# EAGLE design LED_Project (EAGLE 9.2.2)
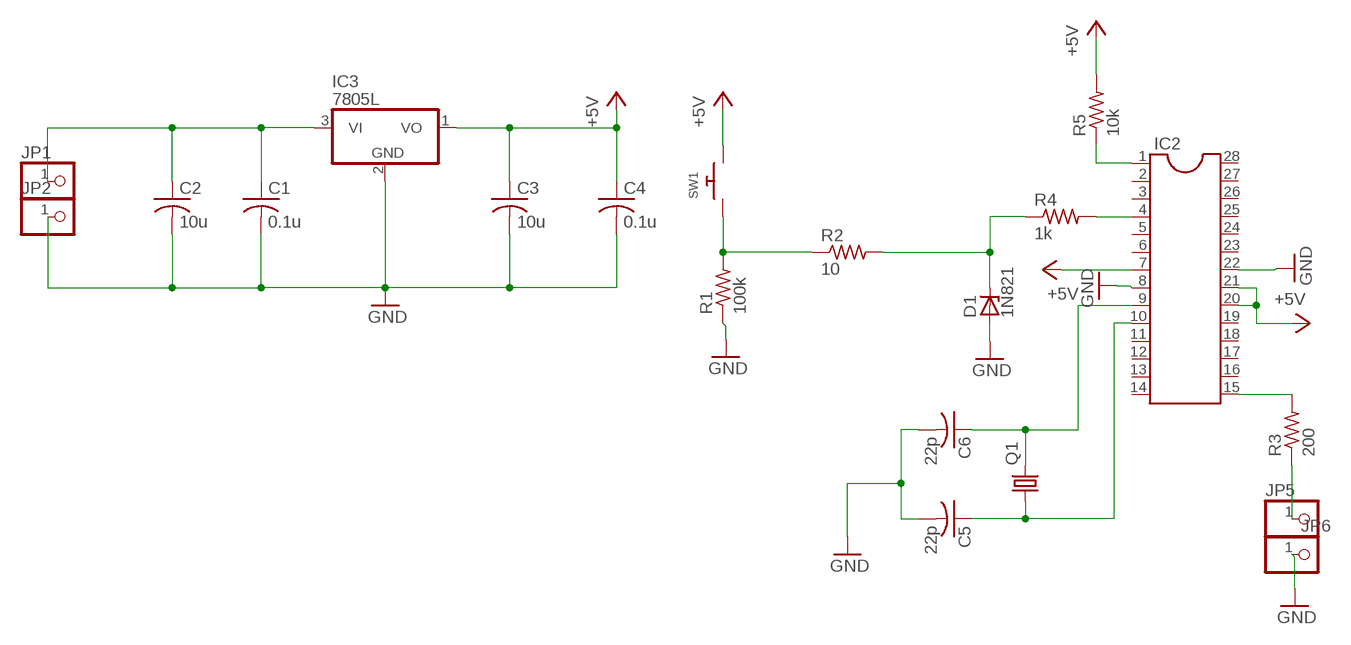
[diagram p0: schematic, sheet 1]

## Parts
C1  0.1u  C-USC0805K  [C0805K]
C2  10u  C-USC0805K  [C0805K]
C3  10u  C-USC0805K  [C0805K]
C4  0.1u  C-USC0805K  [C0805K]
C5  22p  C-USC0805K  [C0805K]
C6  22p  C-USC0805K  [C0805K]
D1  1N821  [DO35Z10]
IC2  DIL28-3  [DIL28-3]
IC3  7805L  [TO92]
JP1  PINHD-1X1  [1X01]
JP2  PINHD-1X1  [1X01]
JP5  PINHD-1X1  [1X01]
JP6  PINHD-1X1  [1X01]
Q1  CRYSTALHC49S  [HC49/S]
R1  100k  R-US_R0805  [R0805]
R2  10  R-US_R0805  [R0805]
R3  200  R-US_R0805  [R0805]
R4  1k  R-US_R0805  [R0805]
R5  10k  R-US_R0805  [R0805]
SW1  SWITCH_PUSHBUTTONSOFTTOUCHSMD_SJ  [PUSHBUTTON_SMD_SJ]

## Nets
+5V: C3.1 C4.1 IC2.7 IC2.20 IC2.21 IC3.1(VO) R5.2 SW1.P$2
GND: C1.2 C2.2 C3.2 C4.2 C5.2 C6.2 D1.A IC2.8 IC2.22 IC3.2(GND) JP2.1 JP6.1 R1.1
N$1: C1.1 C2.1 IC3.3(VI) JP1.1
N$2: R1.2 R2.1 SW1.P$1
N$3: IC2.4 R4.2
N$4: C6.1 IC2.9 Q1.2
N$5: D1.C R2.2 R4.1
N$6: IC2.15 R3.2
N$7: JP5.1 R3.1
N$10: C5.1 IC2.10 Q1.1
N$12: IC2.1 R5.1
Unconnected: IC2.2 IC2.3 IC2.5 IC2.6 IC2.11 IC2.12 IC2.13 IC2.14 IC2.16 IC2.17 IC2.18 IC2.19 IC2.23 IC2.24 IC2.25 IC2.26 IC2.27 IC2.28

## Library data of the parts
C1-C6 = adafruit:C-US: CAPACITOR, American symbol
D1 = diode:1N821: Reference DIODE temperature compensated, 6,2 V
IC2 = ic-package:DIL28: Dual In Line
IC3 = adafruit:78*: Positive VOLTAGE REGULATOR Added bigger pads to the TO-92 package
JP1 JP2 JP5 JP6 = adafruit:PINHD-1X1: Pin header 1x1 for 0.1" spacing With round pins
Q1 = adafruit:CRYSTAL: CRYSTAL; OC_FARNELL: 1667008; OC_NEWARK: unknown
R1-R5 = adafruit:R-US_: RESISTOR, American symbol
SW1 = adafruit:SWITCH_PUSHBUTTON: Buttons SOFTTOUCHSMD_SJ - Soft touch temporary push button (Super Junk Akihabara) Compatible with SKPMANE010 [Mouser: 688-SKPMAN] C&K_KSS = Digikey: KSS221GLFS

## Net classes
0 default: width 0.305 mm, drill 0.508 mm, clearance 0.305 mm

## Board
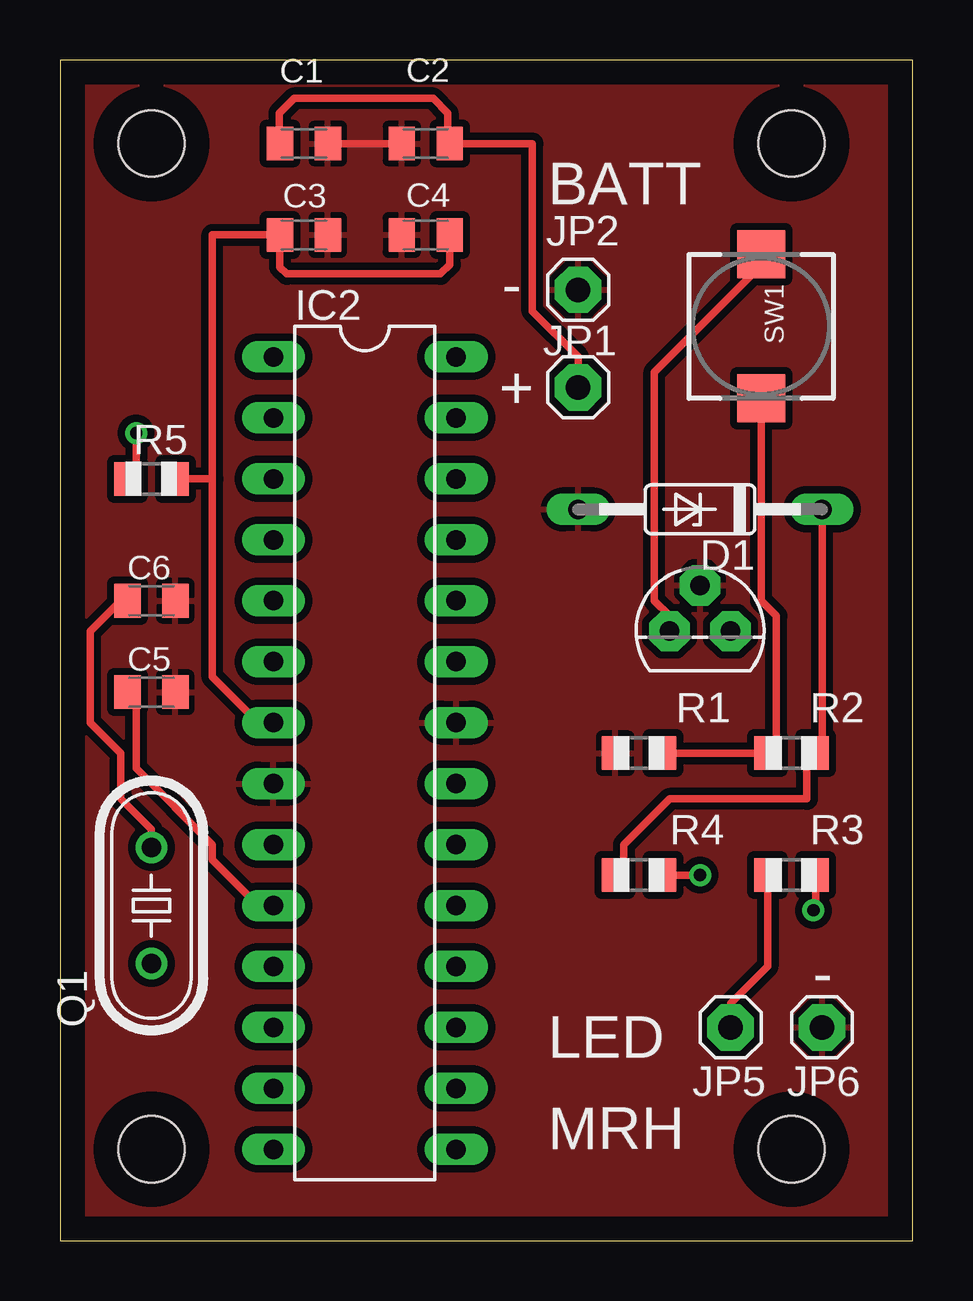
[diagram p1: board, top side]
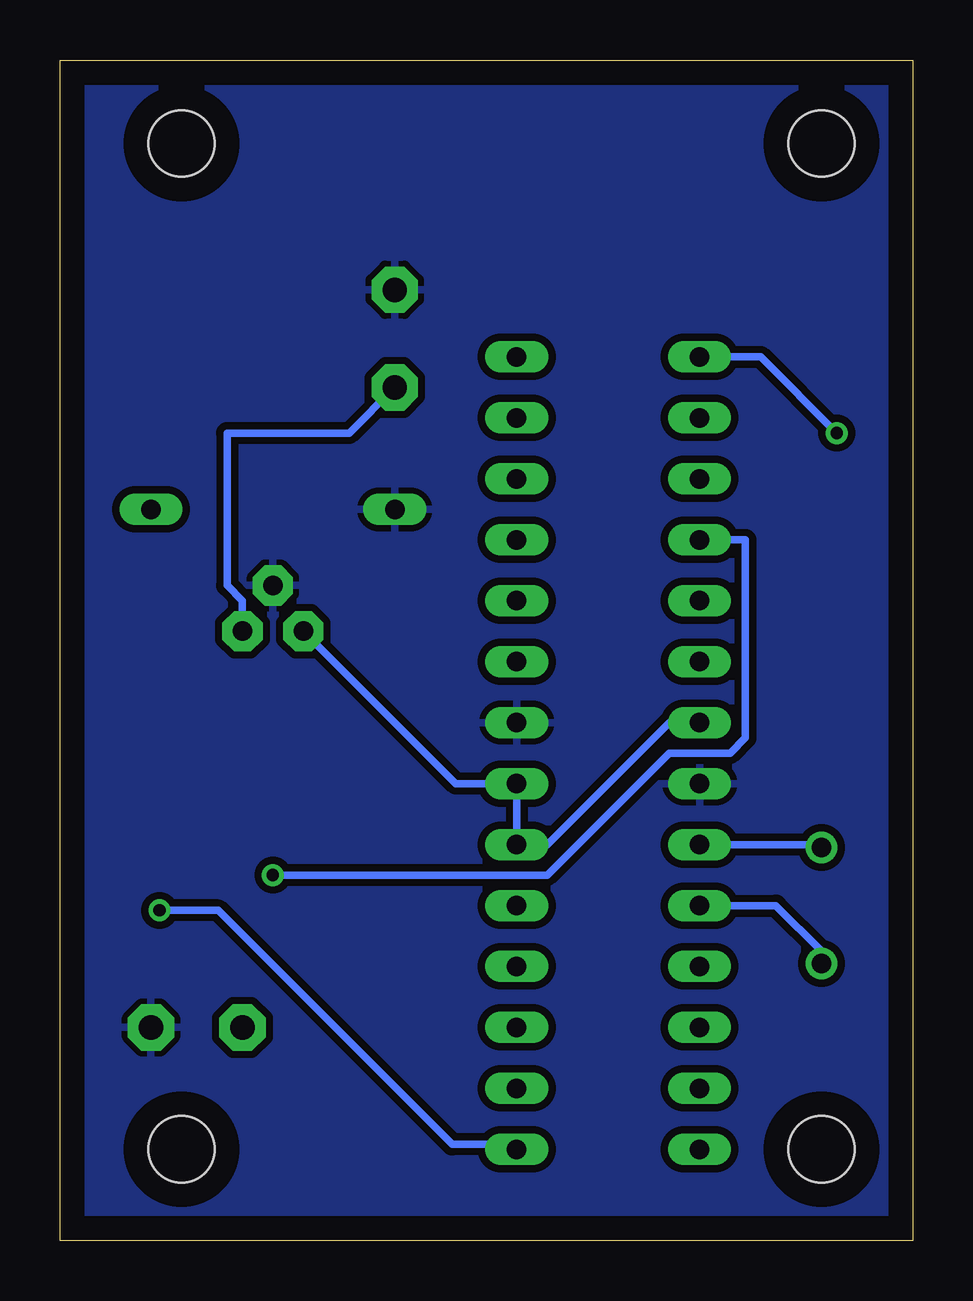
[diagram p2: board, bottom side, seen from below]

Size 35.54 x 49.2 mm. Coordinates in mm from the lower left corner, seen from the top.
Outline: 0,0 35.54,0 35.54,49.2 0,49.2 0,0
Copper layers (1*16): Top 0.035mm / dielectric 1.5mm / Bottom 0.035mm
Design rules "default": minimum track width 6mil, minimum drill 0.35mm, track to track 6mil, track to pad 6mil, pad to pad 6mil, via to via 6mil, smd to smd 6mil, copper to edge 40mil, drill to drill 6mil, minimum pad ring 10mil, minimum via ring 8mil, stop-mask expansion 4mil, vias tented up to drill 0mil, thermal gap 10mil
Holes 2.77 mm at 3.81,3.81 30.48,3.81 3.81,45.72 30.48,45.72

### Footprints (pad centres in the part's own frame; a part is rotated, then mirrored left to right if it is on the bottom)
C0805K = smd 1.1 x 1.4: 1 -1,0; 2 1,0
DO35Z10 = drill 0.813 long: A 5.08,0; C -5.08,0
DIL28-3 = drill 0.813 long: 1 -16.51,-3.81; 2 -13.97,-3.81; 3 -11.43,-3.81; 4 -8.89,-3.81; 5 -6.35,-3.81; 6 -3.81,-3.81; 7 -1.27,-3.81; 8 1.27,-3.81; 9 3.81,-3.81; 10 6.35,-3.81; 11 8.89,-3.81; 12 11.43,-3.81; 13 13.97,-3.81; 14 16.51,-3.81; 15 16.51,3.81; 16 13.97,3.81; 17 11.43,3.81; 18 8.89,3.81; 19 6.35,3.81; 20 3.81,3.81; 21 1.27,3.81; 22 -1.27,3.81; 23 -3.81,3.81; 24 -6.35,3.81; 25 -8.89,3.81; 26 -11.43,3.81; 27 -13.97,3.81; 28 -16.51,3.81
TO92 = drill 0.813 pad 1.676 octagon: 1 -1.27,0; 2 0,1.905; 3 1.27,0
1X01 = drill 1.016 pad 1.93 octagon: 1 0,0
HC49/S = drill 0.813: 1 -2.413,0; 2 2.413,0
R0805 = smd 1.1 x 1.4: 1 -1,0; 2 1,0
PUSHBUTTON_SMD_SJ = smd 2 x 2: P$1 3,0; P$2 -3,0

### Placement (x,y rotation side)
C1  10.16,45.72 0 top
C2  15.24,45.72 180 top
C3  10.16,41.91 0 top
C4  15.24,41.91 180 top
C5  3.81,22.86 0 top
C6  3.81,26.67 0 top
D1  26.67,30.48 180 top
IC2  12.7,20.32 270 top
IC3  26.67,25.4 0 top
JP1  21.59,35.56 0 top
JP2  21.59,39.62 0 top
JP5  27.94,8.89 0 top
JP6  31.75,8.89 0 top
Q1  3.81,13.97 90 top
R1  24.13,20.32 0 top
R2  30.48,20.32 0 top
R3  30.48,15.24 0 top
R4  24.13,15.24 0 top
R5  3.81,31.75 0 top
SW1  29.21,38.1 270 top

### Tracks (layer width: path | path; a pad name or v marks a point on that pad's centre or on a via)
+5V
  Top 0.305: C4.1 16.24,40.67 15.85,40.28 9.45,40.28 9.16,40.57 C3.1 6.35,41.91 6.35,31.75 | 6.35,31.75 R5.2 | 6.35,31.75 6.35,23.5 8.26,21.59 IC2.7 | IC3.1 25.4,26.04 24.77,26.67 24.77,36.2 29.21,40.64 SW1.P$2
  Bottom 0.305: IC2.7 10.16,21.59 15.24,16.51 IC2.20 IC2.21 19.05,19.05 IC3.1
GND
  Top 0.305: C1.2 C2.2
  pour Top: -2.54,68.58 -2.54,-8.89 46.99,-8.89 46.99,68.58
  pour Bottom: 44.45,66.04 -1.27,66.04 -1.27,-6.35 44.45,-6.35
N$1
  Top 0.305: 16.15,45.77 C2.1 arc90 C2.1 | C1.1 arc-90 9.14,45.74 9.14,46.99 9.75,47.6 15.54,47.6 16.15,46.99 16.15,45.77 | 16.15,45.77 arc-90 16.2,45.72 | 16.15,45.77 arc90 16.2,45.72 | C2.1 16.2,45.72 | 16.15,45.77 arc-90 16.2,45.72 | C2.1 19.68,45.72 19.68,38.73 21.59,36.83 JP1.1
  Bottom 0.305: IC3.3 27.94,26.67 28.57,27.3 28.57,33.66 23.5,33.66 JP1.1
N$2
  Top 0.305: R1.2 R2.1 29.84,20.32 29.84,26.04 29.21,26.67 SW1.P$1
N$3  (via drill 0.51)
  Top 0.305: v26.67,15.24 R4.2
  Bottom 0.305: v26.67,15.24 15.24,15.24 10.16,20.32 7.62,20.32 6.99,20.95 6.99,29.21 IC2.4
N$4
  Top 0.305: Q1.2 3.81,17.14 2.54,18.41 2.54,20.32 1.27,21.59 1.27,25.4 2.54,26.67 C6.1
  Bottom 0.305: IC2.9 3.81,16.51 Q1.2
N$5
  Top 0.305: R4.1 23.5,15.24 23.5,16.51 25.4,18.41 31.11,18.41 31.11,20.32 R2.2 31.75,20.32 D1.C
N$6  (via drill 0.51)
  Top 0.305: R3.2 31.48,13.85 v31.39,13.77
  Bottom 0.305: v31.39,13.77 28.96,13.77 19.2,4.01 16.71,4.01 IC2.15
N$7
  Top 0.305: JP5.1 27.94,9.89 29.48,11.43 R3.1
N$10
  Top 0.305: IC2.10 8.26,13.97 6.35,15.88 6.35,16.51 3.17,19.68 3.17,22.86 C5.1
  Bottom 0.305: IC2.10 5.71,13.97 3.81,12.06 Q1.1
N$12  (via drill 0.51)
  Top 0.305: v3.17,33.66 3.17,31.75 R5.1
  Bottom 0.305: v3.17,33.66 6.35,36.83 IC2.1

### Text on the board
tPlace: BATT | - | + | - | LED | MRH